# Altium schematic sheet main.SchDoc: Pulser Testboard
size A4; Date: 04.08.2023; Author: villanif; DrawnBy: villanif; Engineer: villanif; DocumentNumber: 1; Revision: 1; SheetNumber: 1; SheetTotal: 1; FileInfo: main.SchDoc
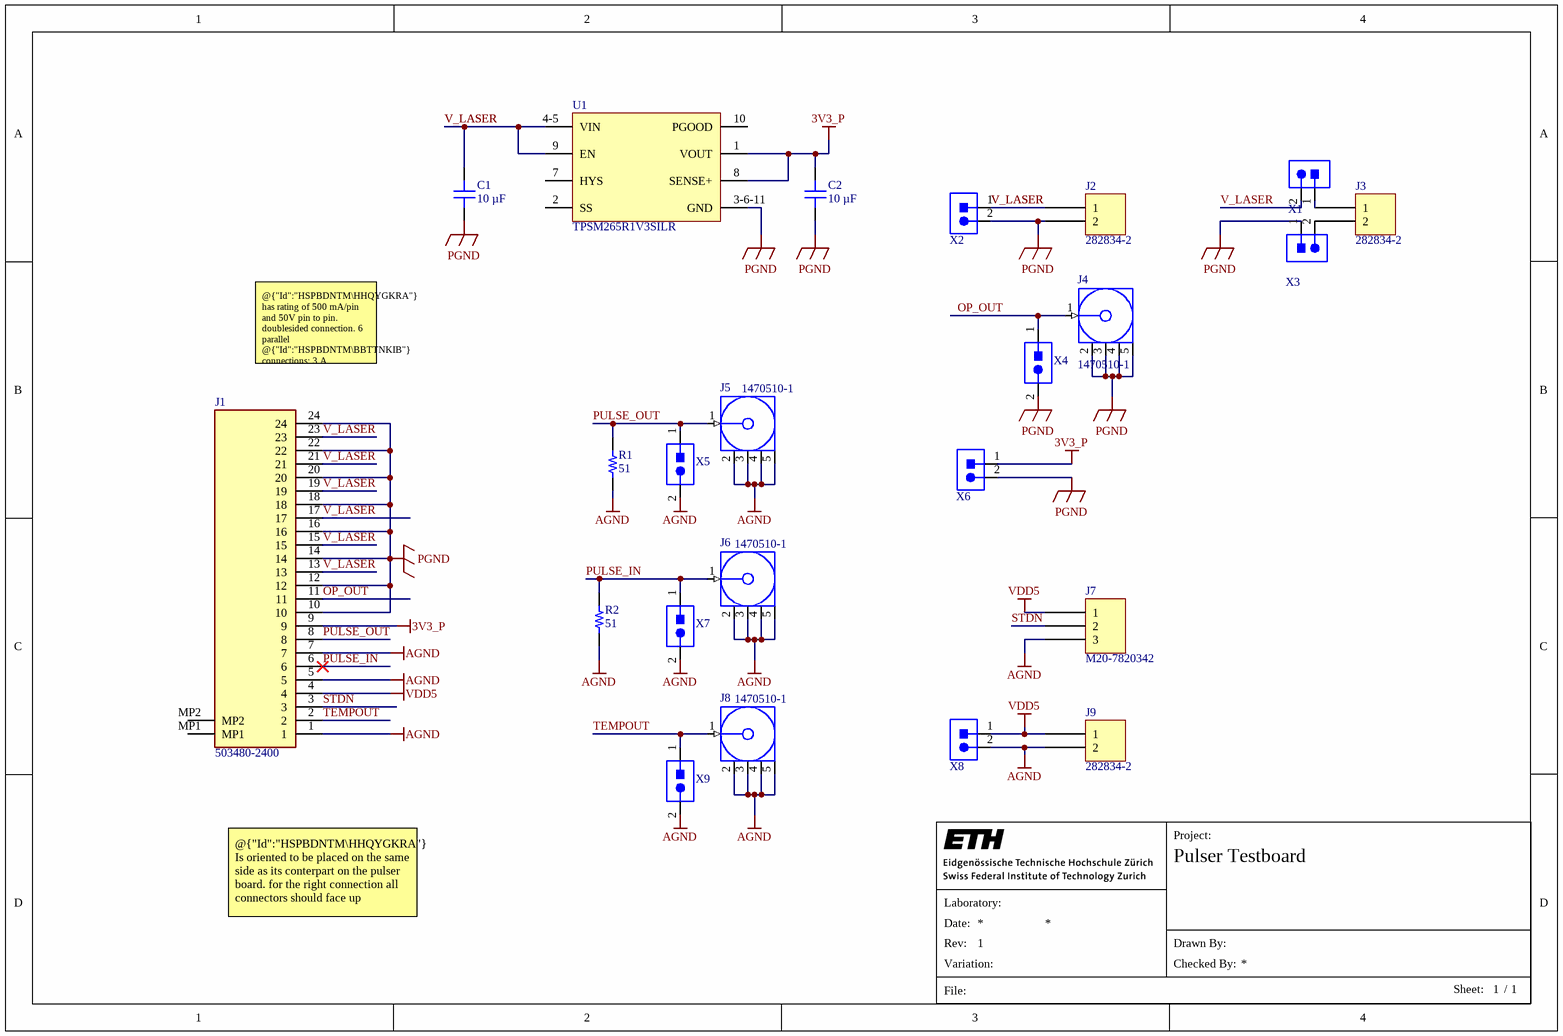
[diagram p0: main.SchDoc]

## Parts
C1  10 µF  [CAP 1210_3225 - 1MM]
C2  10 µF  [CAP 1210_3225 - 1MM]
J1  503480-2400  [5034802400]
J2  282834-2  [TE 282834-2]
J3  282834-2  [TE 282834-2]
J4  1470510-1  [5-1814832-1]
J5  1470510-1  [5-1814832-1]
J6  1470510-1  [5-1814832-1]
J7  M20-7820342  [HARWIN M20-7820345]
J8  1470510-1  [5-1814832-1]
J9  282834-2  [TE 282834-2]
R1  51  [RES 0201_0603]
R2  51  [RES 0201_0603]
U1  TPSM265R1V3SILR  [FP-SIL0010C-MFG]
X1  68000-102HLF  [68000-102HLF]  (value not drawn)
X2  68000-102HLF  [68000-102HLF]  (value not drawn)
X3  68000-102HLF  [68000-102HLF]  (value not drawn)
X4  68000-102HLF  [68000-102HLF]  (value not drawn)
X5  68000-102HLF  [68000-102HLF]  (value not drawn)
X6  68000-102HLF  [68000-102HLF]  (value not drawn)
X7  68000-102HLF  [68000-102HLF]  (value not drawn)
X8  68000-102HLF  [68000-102HLF]  (value not drawn)
X9  68000-102HLF  [68000-102HLF]  (value not drawn)

## Nets
3V3_P: C2.2 J1.9 U1.1(VOUT) U1.8(SENSE+) X6.1
AGND: J1.1 J1.5 J1.7 J5.2(GND) J5.3(GND) J5.4(GND) J5.5(GND) J6.2(GND) J6.3(GND) J6.4(GND) J6.5(GND) J7.3 J8.2(GND) J8.3(GND) J8.4(GND) J8.5(GND) J9.2 R1.1 R2.1 X5.2 X7.2 X8.2 X9.2
PGND: C1.1 C2.1 J1.10 J1.12 J1.14 J1.16 J1.18 J1.20 J1.22 J1.24 J2.2 J4.2(GND) J4.3(GND) J4.4(GND) J4.5(GND) U1.3-6-11(GND) X2.2 X3.1 X4.2 X6.2
VDD5: J1.4 J7.1 J9.1 X8.1
OP_OUT: J1.11 J4.1(Signal) X4.1
PULSE_IN: J1.6 J6.1(Signal) R2.2 X7.1
PULSE_OUT: J1.8 J5.1(Signal) R1.2 X5.1
STDN: J1.3 J7.2
TEMPOUT: J1.2 J8.1(Signal) X9.1
V_LASER: C1.2 J1.13 J1.15 J1.17 J1.19 J1.21 J1.23 J2.1 U1.4-5(VIN) U1.9(EN) X1.2 X2.1
NetJ3_1: J3.1 X1.1
NetJ3_2: J3.2 X3.2

Not connected (* = marked no-connect by the designer): J1 MP1 MP2; U1 2(SS) 7(HYS) 10(PGOOD)

## Notes on the sheet
- @{"Id":"HSPBDNTM\HHQYGKRA"} has rating of 500 mA/pin and 50V pin to pin. doublesided connection. 6 parallel @{"Id":"HSPBDNTM\BBTTNKIB"} connections: 3 A
- Place R1 or R2 only if termination is necessary and size accordingly
- @{"Id":"HSPBDNTM\HHQYGKRA"} Is oriented to be placed on the same side as its conterpart on the pulser board. for the right connection all connectors should face up
- Project:
- Laboratory:
- Date:
- File:
- Rev:
- Variation:
- Drawn By:
- Checked By:
- Sheet:
- /

## Library data of the parts
C1 C2 = GRM32EC72A106ME05L: CAP CER 10UF 100V X7S 1210; manufacturer: Murata Electronics; Tolerance: ±20%; Part Number: GRM32EC72A106ME05L; Applications: General Purpose; Capacitance: 10 µF; componentlink1description: Datasheet; componentlink1url: https://search.murata.co.jp/Ceramy/image/img/A01X/G101/ENG/GRM32EC72A106ME05-01A.pdf; componentlink2description: DigiKey Link; componentlink2url: https://www.digikey.com/en/products/detail/murata-electronics/GRM32EC72A106ME05L/16033383; Device Package: 1210 (3225 Metric); lastupdated: 16/07/2023 19:11:38; Lifecycle Status: Active; Minimum Order: 1; Mounting Type: Surface Mount, MLCC; Operating Temperature: -55°C ~ 125°C; Package / Case: 1210 (3225 Metric); packaging: TapeAndReel; partid: 44868; Part Status: Active; price: 0.28; series: GRM; Size / Dimension: 0.126" L x 0.098" W (3.20mm x 2.50mm); Supplier 1: Digi-Key; Supplier Part Number 1: 490-GRM32EC72A106ME05LCT-ND; Temperature Coefficient: X7S; Thickness (Max): 0.106" (2.70mm); Voltage - Rated: 100V; Value: 10 µF
J1 = 503480-2400: Connector; Manufacturer_Name: Molex; Datasheet Link: https://componentsearchengine.com/Datasheets/1/503480-2400.pdf; Height: 1.87mm; Manufacturer_Part_Number: 503480-2400; Mouser Part Number: 538-503480-2400; Mouser Price/Stock: https://www.mouser.co.uk/ProductDetail/Molex/503480-2400?qs=OAhjpuo3Vu7efIoxFh9AOw%3D%3D; System: *
J2 J3 J9 = 282834-2: TERM BLK 2P SIDE ENT 2.54MM PCB; Manufacturer: TE Connectivity AMP Connectors; Current: 10A; Mating Orientation: Horizontal with Board; Number of Levels: 1; Pitch: 0.100" (2.54mm); Positions Per Level: 2; Voltage: 150V; Wire Gauge: 16-30 AWG; Wire Termination: Screw - Rising Cage Clamp; Part Number: 282834-2; Color: Green; ComponentLink1Description: Datasheet; ComponentLink1URL: https://www.te.com/commerce/DocumentDelivery/DDEController?Action=srchrtrv&DocNm=282834&DocType=Customer+Drawing&DocLang=English; ComponentLink2Description: DigiKey Link; ComponentLink2URL: http://digikey.com/product-detail/en/te-connectivity-amp-connectors/282834-2/A98333-ND/1150135; LastUpdated: 15/01/2020 04:15:38; Lifecycle Status: Active; Minimum Order: 1; Mounting Type: Through Hole; Packaging: Bulk; Part Status: Active; Price: 0.88; Series: Buchanan; Supplier 1: DigiKey; Supplier Part Number 1: A98333-ND
J4-J6 J8 = CMP-00606-1: SMA Connector Jack, Female Socket 50 Ohm Through Hole Solder; Manufacturer: TE Connectivity; Body Material: Brass; Dielectric Material: PTFE; Frequency: 6GHz; Gender: Male; Connector Type: SMA,Jack; Impedance: 50R; PCB Mounting Orientation: Vertical; Mount: Through Hole; Case/Package: SMA; Termination: Solder; Orientation: Straight; Packaging: Bag; Package Quantity: 100; Length: 13.97mm; Radiation Hardening: No; ELV: Compliant; Manufacturer Part Number: 1470510-1; Supplier: Digi-Key; Supplier Part Number: A119269-ND; ComponentLink1Description: 1470510-1?RQPN=1470510-1; ComponentLink1URL: http://www.te.com/catalog/pn/en/1470510-1?RQPN=1470510-1
J7 = M20-7820342: CONN RCPT 3POS 0.1 GOLD PCB; Manufacturer: Harwin Inc.; Connector Type: Receptacle; Contact Length - Post: 0.118" (3.00mm); Current Rating (Amps): 3A; Mated Stacking Heights: 11.04mm, 12.63mm; Material Flammability Rating: UL94 V-0; Number of Positions: 3; Number of Positions Loaded: All; Pitch - Mating: 0.100" (2.54mm); Style: Board to Board or Cable; Part Number: M20-7820342; ComponentLink1Description: Datasheet; ComponentLink1URL: https://cdn.harwin.com/pdfs/Harwin_PC_Connectors_M20.pdf; ComponentLink2Description: DigiKey Link; ComponentLink2URL: https://www.digikey.com/en/products/detail/harwin-inc/M20-7820342/3727752; Contact Finish - Mating: Gold; Contact Finish - Post: Tin; Contact Finish Thickness - Mating: Flash; Contact Type: Female Socket; Fastening Type: Push-Pull; Insulation Color: Black; Insulation Height: 0.335" (8.51mm); LastUpdated: 21/09/2022 18:55:13; Lifecycle Status: Active; Minimum Order: 1; Mounting Type: Through Hole; Number of Rows: 1; Operating Temperature: -40°C ~ 105°C; Packaging: Tube; Part Status: Active; Price: 0.42; Series: M20; Supplier 1: DigiKey; Supplier Part Number 1: 952-1783-ND; Termination: Solder
R1 R2 = ERJ-1GNF51R0C: RES SMD 51 OHM 1% 1/20W 0201; Manufacturer: Panasonic; Manufacturer Part Number: ERJ1GNF51R0C; Power: 50mW; Rated Temperature: 70°C; Temperature Coefficient: 200ppm/°C; Working Voltage: 25V; Package Height: 0.23mm; Package Length: 0.6mm; Package Width: 0.3mm; Reference Standard: AEC-Q200; Supplier: Mouser; Supplier Part Number: 667-ERJ-1GNF51R0C; RoHS: Yes; Category: Chip SMD Resistors; Stock: 39473; Pricing: 1=0.1, 10=0.033, 50=0.033, 100=0.015, 1000=0.011, 10000=0.007 (USD); Mounting Technology: Surface Mount; Pins: 2; Package Shape: Rectangular; Case/Package: 0201; Terminal Finish: Nickel; Min Operating Temperature: -55°C; Max Operating Temperature: 125°C; Tolerance: 1%; JESD-609 Code: e3; Resistor Type: FIXED RESISTOR; Construction: Rectangular; Package Style: SMTMeter; Packaging: Tape and Reel; Value: 51; Technology: METAL GLAZE/THICK FILM; Termination: Wraparound; Reach SVHC Compliant: Yes; RoHS Compliant: Yes; ComponentLink1URL: https://datasheet.ciiva.com:443/pdfs/VipMasterIC/IC/PANA/PANA-S-A0009889626/PANA-S-A0009889626-1.pdf?src-supplier=IHS+Markit; ComponentLink1Description: https://datasheet.ciiva.com:443/pdfs/VipMasterIC/IC/PANA/PANA-S-A0009889626/PANA-S-A0009889626-1.pdf?src-supplier=IHS+Markit; ComponentLink2URL: https://datasheet.ciiva.com/43467/1678782-43467023.pdf?src-supplier=Farnell; ComponentLink2Description: https://datasheet.ciiva.com/43467/1678782-43467023.pdf?src-supplier=Farnell; ComponentLink3URL: https://datasheet.ciiva.com/24130/aoa0000ce2-24130655.pdf?src-supplier=Mouser; ComponentLink3Description: https://datasheet.ciiva.com/24130/aoa0000ce2-24130655.pdf?src-supplier=Mouser; ComponentLink4URL: https://datasheet.ciiva.com/46375/1678782-46375932.pdf?src-supplier=Element14; ComponentLink4Description: https://datasheet.ciiva.com/46375/1678782-46375932.pdf?src-supplier=Element14; ComponentLink5URL: https://datasheet.ciiva.com/7891/aoa0000ce2-7891288.pdf?src-supplier=Element14; ComponentLink5Description: https://datasheet.ciiva.com/7891/aoa0000ce2-7891288.pdf?src-supplier=Element14; Supplier 1: Mouser; Supplier Part Number 1: 667-ERJ-1GNF51R0C
U1 = TPSM265R1V3SILR: 3-V TO 65-V INPUT, 100-MA, STEP-; Manufacturer: Texas Instruments; Supplier 1: Mouser; Manufacturer Part Number: TPSM265R1V3SILR; RoHS: Yes; Category: Voltage Regulators - Switching; Stock 1: 6360; Pricing 1: 1=4.24, 10=3.61, 50=3.61, 100=3.13, 1000=2.25, 10000=2.13 (USD); Supplier Part Number 1: 595-TPSM265R1V3SILR
X1-X3 X6 X8 = CMP-00100-3: 2 Positions Header, Unshrouded Connector 0.100" (2.54mm) Through Hole Gold or Gold, GXT™; Manufacturer: Amphenol FCI; Number of Positions: 2; Connector Type: Male Pin; Current Rating: 3A; Gender: Male; Insulation Resistance: 5GR; Mating Post Length: 5.84mm; Max Voltage Rating (AC): 1.5kV; Packaging: Bulk; Supplier: Digikey; Supplier Part Number: 609-3500-ND; ComponentLink1Description: 68000-274228-5149165.pdf; ComponentLink1URL: https://datasheet.ciiva.com/5149/68000-274228-5149165.pdf; Pitch: 2.54mm; Manufacturer Part Number: 68000-102HLF; Number of Rows: 1; Termination: Solder; Contact Mating Length: 0.23inch; Case/Package: 100; Colour: Black; ComponentLink2Description: 68000-722084.pdf; ComponentLink2URL: https://datasheet.ciiva.com/722/68000-722084.pdf; ComponentLink3Description: 68000-10149324.pdf; ComponentLink3URL: https://datasheet.ciiva.com/10149/68000-10149324.pdf; ComponentLink4Description: 68000-16726309.pdf; ComponentLink4URL: https://datasheet.ciiva.com/16726/68000-16726309.pdf; Contact Gender: Male; Contact Material: Bronze; Contact Plating: Nickel,Gold,GXT; Depth: 2.41mm; Flammability Rating: UL94 V-0; Housing Colour: Black; Housing Material: Thermoplastic; Lead Free: Lead Free; Length: 5.08mm; Max Operating Temperature: 125°C; Min Operating Temperature: -65°C; Number of Contacts: 2; Orientation: Straight; Package Quantity: 100; Radiation Hardening: No; Termination Post Length: 2.41mm; Voltage Rating: 1.5kV; Voltage Rating (DC): 1.5kV
X4 X5 X7 X9 = CMP-00100-3_1: 2 Positions Header, Unshrouded Connector 0.100" (2.54mm) Through Hole Gold or Gold, GXT™; Manufacturer: Amphenol FCI; Number of Positions: 2; Connector Type: Male Pin; Current Rating: 3A; Gender: Male; Insulation Resistance: 5GR; Mating Post Length: 5.84mm; Max Voltage Rating (AC): 1.5kV; Packaging: Bulk; Supplier: Digikey; Supplier Part Number: 609-3500-ND; ComponentLink1Description: 68000-274228-5149165.pdf; ComponentLink1URL: https://datasheet.ciiva.com/5149/68000-274228-5149165.pdf; Pitch: 2.54mm; Manufacturer Part Number: 68000-102HLF; Number of Rows: 1; Termination: Solder; Contact Mating Length: 0.23inch; Case/Package: 100; Colour: Black; ComponentLink2Description: 68000-722084.pdf; ComponentLink2URL: https://datasheet.ciiva.com/722/68000-722084.pdf; ComponentLink3Description: 68000-10149324.pdf; ComponentLink3URL: https://datasheet.ciiva.com/10149/68000-10149324.pdf; ComponentLink4Description: 68000-16726309.pdf; ComponentLink4URL: https://datasheet.ciiva.com/16726/68000-16726309.pdf; Contact Gender: Male; Contact Material: Bronze; Contact Plating: Nickel,Gold,GXT; Depth: 2.41mm; Flammability Rating: UL94 V-0; Housing Colour: Black; Housing Material: Thermoplastic; Lead Free: Lead Free; Length: 5.08mm; Max Operating Temperature: 125°C; Min Operating Temperature: -65°C; Number of Contacts: 2; Orientation: Straight; Package Quantity: 100; Radiation Hardening: No; Termination Post Length: 2.41mm; Voltage Rating: 1.5kV; Voltage Rating (DC): 1.5kV